# Altium project SupplyBoard.PrjPcb
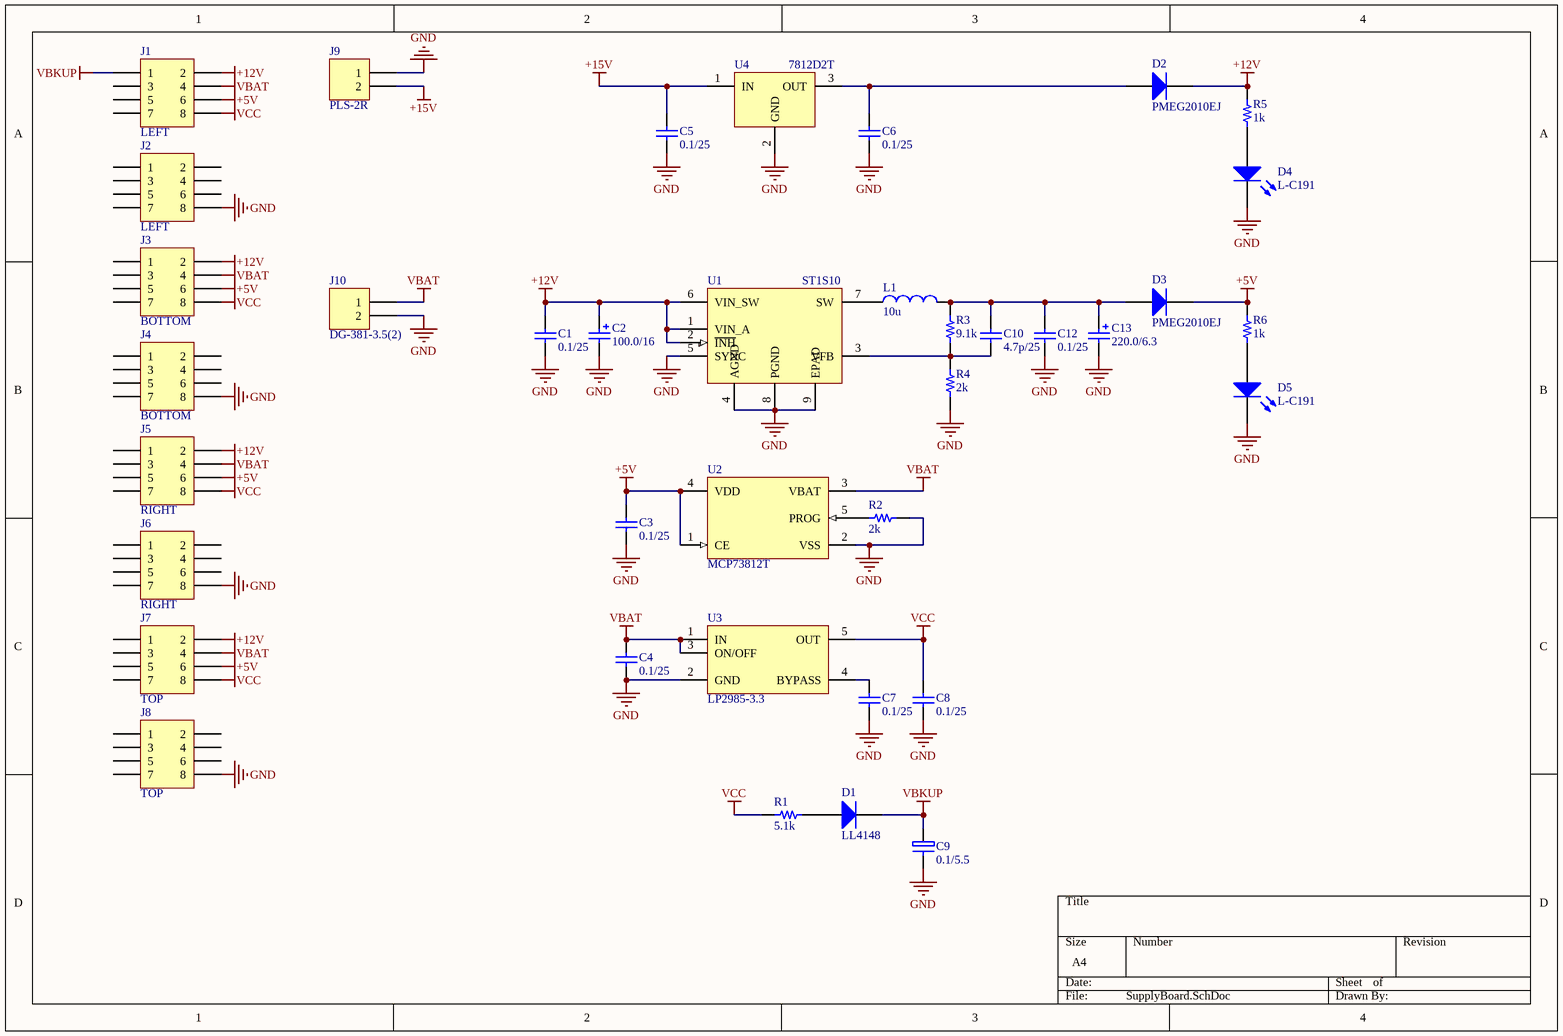
[diagram p0: SupplyBoard.SchDoc]
1 sheet, 38 parts. Net scope: global (net labels, ports and power ports of the same name join across sheets).
Board file: SupplyBoard.PcbDoc

## Sheet SupplyBoard.SchDoc
size A4

### Parts
C1  0.1/25  [CAP0402]
C2  100.0/16  [SMB]
C3  0.1/25  [CAP0402]
C4  0.1/25  [CAP0402]
C5  0.1/25  [CAP0402]
C6  0.1/25  [CAP0402]
C7  0.1/25  [CAP0402]
C8  0.1/25  [CAP0402]
C9  0.1/5.5  [EDLC1205H]
C10  4.7p/25  [CAP0402]
C12  0.1/25  [CAP0402]
C13  220.0/6.3  [SMC]
D1  LL4148  [SOD80]
D2  PMEG2010EJ  [SOD523]
D3  PMEG2010EJ  [SOD523]
D4  L-C191  [LED0603]
D5  L-C191  [LED0603]
J1  LEFT  [PBDM-8]
J2  LEFT  [PBDM-8]
J3  BOTTOM  [PBDM-8]
J4  BOTTOM  [PBDM-8]
J5  RIGHT  [PBDM-8]
J6  RIGHT  [PBDM-8]
J7  TOP  [PBDM-8]
J8  TOP  [PBDM-8]
J9  PLS-2R  [PLS-2R]
J10  DG-381-3.5(2)  [DG-381-3.5(2)]
L1  10u  [SND0705]
R1  5.1k  [RES0402]
R2  2k  [RES0402]
R3  9.1k  [RES0402]
R4  2k  [RES0402]
R5  1k  [RES0402]
R6  1k  [RES0402]
U1  ST1S10  [PowerSO8]
U2  MCP73812T  [SOT23-5]
U3  LP2985-3.3  [SOT23-5]
U4  7812D2T  [D2PAK-3]

### Nets
+5V: C3.2 D3.1 J1.6 J3.6 J5.6 J7.6 R6.2 U2.1(CE) U2.4(VDD)
+12V: C1.2 C2.2 D2.1 J1.2 J3.2 J5.2 J7.2 R5.2 U1.1(VIN_A) U1.2(~{INH}) U1.6(VIN_SW)
+15V: C5.2 J9.2 U4.1(IN)
GND: C1.1 C2.1 C3.1 C4.1 C5.1 C6.1 C7.1 C8.1 C9.1 C12.1 C13.1 D4.1 D5.1 J2.8 J4.8 J6.8 J8.8 J9.1 J10.2 R2.1 R4.1 U1.4(AGND) U1.5(SYNC) U1.8(PGND) U1.9(EPAD) U2.2(VSS) U3.2(GND) U4.2(GND)
VBAT: C4.2 J1.4 J3.4 J5.4 J7.4 J10.1 U2.3(VBAT) U3.1(IN) U3.3(ON/OFF)
VBKUP: C9.2 D1.1 J1.1
VCC: C8.2 J1.8 J3.8 J5.8 J7.8 R1.2 U3.5(OUT)
NetC6_2: C6.2 D2.2 U4.3(OUT)
NetC7_2: C7.2 U3.4(BYPASS)
NetC10_1: C10.1 R3.1 R4.2 U1.3(VFB)
NetC10_2: C10.2 C12.2 C13.2 D3.2 L1.2 R3.2
NetD1_2: D1.2 R1.1
NetD4_2: D4.2 R5.1
NetD5_2: D5.2 R6.1
NetL1_1: L1.1 U1.7(SW)
NetR2_2: R2.2 U2.5(PROG)

Not connected (* = marked no-connect by the designer): J1 3 5 7; J2 1 2 3 4 5 6 7; J3 1 3 5 7; J4 1 2 3 4 5 6 7; J5 1 3 5 7; J6 1 2 3 4 5 6 7; J7 1 3 5 7; J8 1 2 3 4 5 6 7

### Library data of the parts
C1 C3-C8 C12 = CAP0402: Ceramic chip capacitor 0402; Value: 0.1; Voltage: 25; PartNumber: CAP0402; Category: Capacitor; Author: oiezhov
C2 = TAJB: Standard tantalum SMT capacitor, size B; PartNumber: TAJB; Value: 100.0; Voltage: 16; Category: Capacitor; Author: oiezhov; ComponentLink1Description: Datasheet; ComponentLink1URL: d:\_AltiumLibs\Pdf\Passive\Capacitors\TAJ - AVX.pdf
C9 = EDLC1205H: Electric double layer capacitor; Value: 0.1; Voltage: 5.5; PartNumber: EDLC1205H; Category: Capacitor; ComponentLink1Description: Datasheet; ComponentLink1URL: d:\_AltiumLibs\Pdf\Passive\Capacitors\dxe-EDLC.pdf; Author: oiezhov
C10 = CAP0402: Ceramic chip capacitor 0402; Value: 4.7p; Voltage: 25; PartNumber: CAP0402; Category: Capacitor; Author: oiezhov
C13 = TAJC: Standard tantalum SMT capacitor, size C; PartNumber: TAJC; Value: 220.0; Voltage: 6.3; Category: Capacitor; ComponentLink1Description: Datasheet; ComponentLink1URL: d:\_AltiumLibs\Pdf\Passive\Capacitors\TAJ - AVX.pdf; Author: oiezhov
D1 = LL4148: Small Signal Diode; PartNumber: LL4148; Category: Diode; ComponentLink1Description: Datasheet; ComponentLink1URL: d:\_AltiumLibs\Pdf\Discrete\Diode\LL4148.pdf; Author: oiezhov
D2 D3 = PMEG2010EJ: 1 A very low VF MEGA Schottky barrier rectifiers; PartNumber: PMEG2010EJ; Category: Diode; ComponentLink1Description: Datasheet; ComponentLink1URL: d:\_AltiumLibs\Pdf\Discrete\Diode\PMEG2010EH_EJ_ET.pdf; Author: oiezhov
D4 D5 = L-C191: SMD LED, size 0603; Color: Green; PartNumber: L-C191; Category: Optical; ComponentLink1Description: Datasheet; ComponentLink1URL: d:\_AltiumLibs\Pdf\Optical\L-C191YCT.pdff; Author: oiezhov
J1-J8 = PBDM-8: 2x4-pin header, pitch 2.54 mm; PartNumber: PBDM-8; Category: Connector; ComponentLink1Description: Datasheet; ComponentLink1URL: d:\_AltiumLibs\Pdf\Mechanical\Connector\pbsm.pdf; Author: oiezhov
J9 = PLS-2R: 2-pin angle header, pitch 2.54 mm; PartNumber: PLS-2R; Category: Connector; ComponentLink1Description: Datasheet; ComponentLink1URL: d:\_AltiumLibs\Pdf\Mechanical\Connector\PLS, PLD.pdf; Author: oiezhov
J10 = DG-381-3.5(2): 2-pin connector with screws, pitch 3.5 mm; PartNumber: DG-381-3.5(2); Category: Connector; ComponentLink1Description: Datasheet; ComponentLink1URL: d:\_AltiumLibs\Pdf\Mechanical\Connector\DG381.pdf; Author: oiezhov
L1 = SND0705: Power inductor; PartNumber: SND0705; Value: 10u; Category: Inductor; ComponentLink1Description: Datasheet; ComponentLink1URL: d:\_AltiumLibs\Pdf\Passive\Inductors\SND type.pdf; Author: oiezhov
R1-R6 = RES0402: Ceramic chip resistor; PartNumber: RES0402; Category: Resistor; Author: oiezhov
  R1: Value: 5.1k
  R2 R4: Value: 2k
  R3: Value: 9.1k
  R5 R6: Value: 1k
U1 = ST1S10: DC-DC buck converter; PartNumber: ST1S10; Category: IC/Voltage Regulator; ComponentLink1Description: Datasheet; Author: oiezhov
U2 = MCP73812T: Li-Ion/Li-Po battery charge management controller; PartNumber: MCP73812T; Category: IC/Battery Management; ComponentLink1Description: Datasheet; ComponentLink1URL: d:\_AltiumLibs\Pdf\IC\PowerManagement\MCP73811_12.pdf; Author: oiezhov
U3 = LP2985-3.3: Micropower 150 mA Low-Noise Ultra Low-Dropout Regulator; PartNumber: LP2985-3.3; Category: IC/Voltage Regulator; ComponentLink1Description: Datasheet; ComponentLink1URL: d:\_AltiumLibs\Pdf\IC\VoltageRegulator\LP2985.pdf; Author: oiezhov
U4 = 7812D2T: 1.0 A Positive Voltage Regulator; PartNumber: 7812D2T; Category: IC/Voltage Regulator; ComponentLink1Description: Datasheet; ComponentLink1URL: d:\_AltiumLibs\Pdf\IC\VoltageRegulator\7800(ON).pdf; Author: oiezhov